# Altium schematic sheet H_BRIGDE.SchDoc
size A4; SheetNumber: 3; SheetTotal: 4
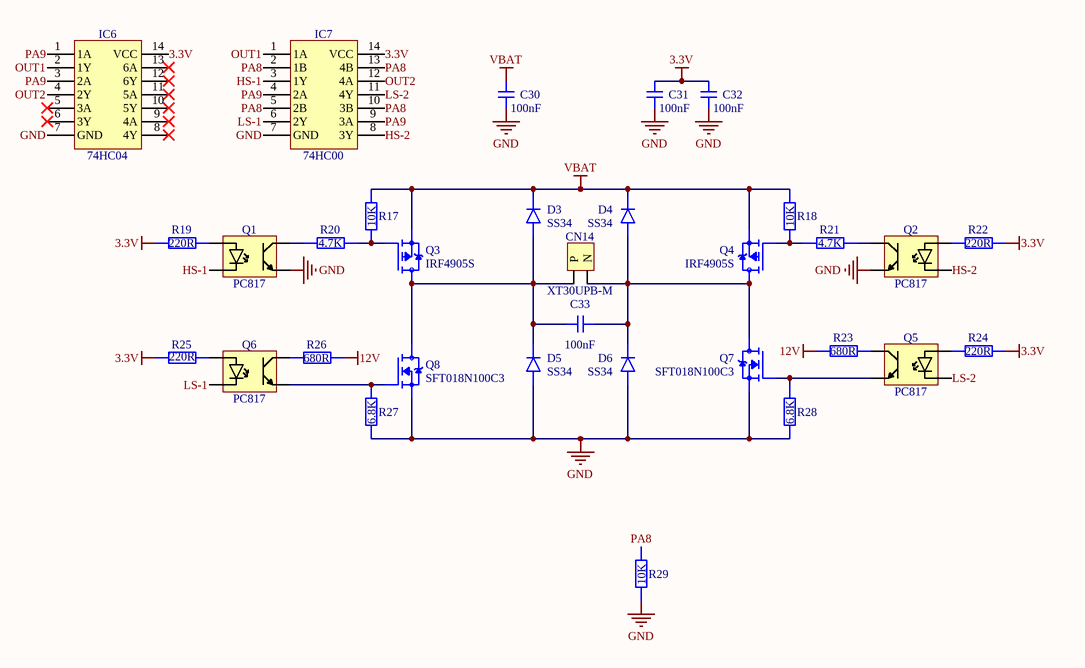
[diagram p0: H_BRIGDE.SchDoc]

## Parts
C30  100nF  [CAP-0603-2]
C31  100nF  [CAP-0603-2]
C32  100nF  [CAP-0603-2]
C33  100nF  [CAP-0603-2]
CN14  XT30UPB-M  [XT30UPB-M]
D3  SS34  [SMA(DO-214AC)]
D4  SS34  [SMA(DO-214AC)]
D5  SS34  [SMA(DO-214AC)]
D6  SS34  [SMA(DO-214AC)]
IC6  74HC04  [SOP-14]
IC7  74HC00  [SOP-14]
Q1  PC817  [SOP-4]
Q2  PC817  [SOP-4]
Q3  IRF4905S  [TO-263]
Q4  IRF4905S  [TO-263]
Q5  PC817  [SOP-4]
Q6  PC817  [SOP-4]
Q7  SFT018N100C3  [TOLL]
Q8  SFT018N100C3  [TOLL]
R17  10K  [RES-0603-1]
R18  10K  [RES-0603-1]
R19  220R  [RES-0603-1]
R20  4.7K  [RES-0603-1]
R21  4.7K  [RES-0603-1]
R22  220R  [RES-0603-1]
R23  680R  [RES-0603-1]
R24  220R  [RES-0603-1]
R25  220R  [RES-0603-1]
R26  680R  [RES-0603-1]
R27  6.8K  [RES-0603-1]
R28  6.8K  [RES-0603-1]
R29  10K  [RES-0603-1]

## Nets
3.3V: C31.1 C32.1 IC6.14(VCC) IC7.14(VCC) R19.2 R22.1 R24.1 R25.2
12V: R23.2 R26.2
GND: C30.2 C31.2 C32.2 D5.1(A) D6.1(A) IC6.7(GND) IC7.7(GND) Q1.3(E) Q2.3(E) Q7.2(S) Q8.2(S) R27.1 R28.1 R29.1
VBAT: C30.1 D3.2(K) D4.2(K) Q3.3(S) Q4.3(S) R17.2 R18.2
HS-1: IC7.3(1Y) Q1.2(K)
HS-2: IC7.8(3Y) Q2.2(K)
LS-1: IC7.6(2Y) Q6.2(K)
LS-2: IC7.11(4Y) Q5.2(K)
OUT1: IC6.2(1Y) IC7.1(1A)
OUT2: IC6.4(2Y) IC7.12(4A)
PA8: IC7.2(1B) IC7.5(2B) IC7.10(3B) IC7.13(4B) R29.2
PA9: IC6.1(1A) IC6.3(2A) IC7.4(2A) IC7.9(3A)
NetC33_1: C33.1 CN14.2(N) D4.1(A) D6.2(K) Q4.2(D) Q7.3(D)
NetC33_2: C33.2 CN14.1(P) D3.1(A) D5.2(K) Q3.2(D) Q8.3(D)
NetQ1_1: Q1.1(A) R19.1
NetQ1_4: Q1.4(C) R20.1
NetQ2_1: Q2.1(A) R22.2
NetQ2_4: Q2.4(C) R21.2
NetQ3_1: Q3.1(G) R17.1 R20.2
NetQ4_1: Q4.1(G) R18.1 R21.1
NetQ5_1: Q5.1(A) R24.2
NetQ5_3: Q5.3(E) Q7.1(G) R28.2
NetQ5_4: Q5.4(C) R23.1
NetQ6_1: Q6.1(A) R25.1
NetQ6_3: Q6.3(E) Q8.1(G) R27.2
NetQ6_4: Q6.4(C) R26.1

Not connected (* = marked no-connect by the designer): IC6 5(3A)* 6(3Y)* 8(4Y)* 9(4A)* 10(5Y)* 11(5A)* 12(6Y)* 13(6A)*

## Notes on the sheet
- Title:
- Size:
- Date:
- Project:
- A4
- Sheet
- of
- File:
- D:\1_ALTIUM

## Library data of the parts
C30-C33 = CL10B104KB8NNNC: 100nF ±10% 50V Ceramic Capacitor X7R 0603; Manufacturer: Samsung Electro-Mechanics; Package: 0603; LCSC Part #: C1591; Mfr.Part #: CL10B104KB8NNNC; DigiKey Part Number: 1276-1000-2-ND; ComponentLink1Description: Link; ComponentLink1URL: https://www.lcsc.com/product-detail/C1591.html?s_z=n_CL10B104KB8NNC; ComponentLink2Description: Link 1; ComponentLink2URL: https://www.digikey.com/en/products/detail/samsung-electro-mechanics/CL10B104KB8NNNC/3886658?s=N4IgTCBcDaIMIBkCMAGAQqgLAaTQDgDki4QBdAXyA
CN14 = XT30UPB-M: Banana and Tip Connector Adapters; Manufacturer: Changzhou Amass Elec; Mfr.Part #: XT30PW-M30.G.Y; LCSC Part #: C428721; Package: Through Hole; DigiKey Part Number: NO; ComponentLink1Description: Link; ComponentLink1URL: https://www.lcsc.com/product-detail/C431092.html?s_z=n_xt30; ComponentLink2Description: Link 1
D3-D6 = SS34: Diode Independent 40V 3A Surface Mount SMA(DO-214AC); Manufacturer: GOODWORK; Mfr.Part #: SS34; Package: SMA(DO-214AC); LCSC Part #: C908680; DigiKey Part Number: NO; ComponentLink1Description: Link; ComponentLink1URL: https://www.lcsc.com/product-detail/C908680.html?s_z=n_C908680
IC6 = SN74HC04DR: 2V~6V 16ns@6V,50pF 2uA 6 1 SOIC-14 Gates and Inverters RoHS; Manufacturer: TI; Mfr.Part #: SN74HC04DR; Package: SOIC-14; LCSC Part #: C6811; DigiKey Part Number: 296-1189-2-ND; ComponentLink1Description: Link; ComponentLink1URL: https://www.lcsc.com/product-detail/C6811.html?s_z=n_74HC04; ComponentLink2Description: Link 1; ComponentLink2URL: https://www.digikey.com/en/products/detail/texas-instruments/SN74HC04DR/276832
IC7 = SN74HC00DR: 2uA 2V~6V 15ns@6V,50pF SOIC-14 Gates and Inverters RoHS; Manufacturer: TI; Mfr.Part #: SN74HC00DR; Package: SOIC-14; LCSC Part #: C10090; DigiKey Part Number: 296-1187-2-ND; ComponentLink1Description: Link; ComponentLink1URL: https://www.lcsc.com/product-detail/C10090.html?s_z=n_74hc00; ComponentLink2Description: Link 1; ComponentLink2URL: https://www.digikey.com/en/products/detail/texas-instruments/SN74HC00DR/276830
Q1 Q2 Q5 Q6 = PC817C-S: Phototransistor Output 5kVrms 1 Channel SOP-4-2.54mm; Manufacturer: UMW; Mfr.Part #: PC817C-S; Package: SOP-4-2.54mm; LCSC Part #: C3008369; DigiKey Part Number: NO; ComponentLink1Description: Link; ComponentLink1URL: https://www.lcsc.com/product-detail/C3008369.html?s_z=n_C3008369; ComponentLink2Description: Link 1
Q3 Q4 = IRF4905STRLPBF: P-Channel 55V 70A 170W Surface Mount D2PAK; Manufacturer: Infineon; Package: D2PAK; Mfr.Part #: IRF4905STRLPBF; LCSC Part #: C2620; DigiKey Part Number: IRF4905STRLPBFTR-ND; ComponentLink1Description: Link; ComponentLink1URL: https://www.lcsc.com/product-detail/C2620.html?s_z=n_IRF4905S; ComponentLink2Description: Link 1; ComponentLink2URL: https://www.digikey.com/en/products/detail/infineon-technologies/IRF4905STRLPBF/1928283?s=N4IgTCBcDaIJICUBiAWAnABgKwGUAqCAMgAoBCSIAugL5A
Q7 Q8 = SFT018N100C3: N-Channel 100V 320A 312W Surface Mount TOLL; Manufacturer: SCILICON; Package: TOLL; Mfr.Part #: SFT018N100C3; LCSC Part #: C42395330; DigiKey Part Number: NO; ComponentLink1Description: Link; ComponentLink1URL: https://www.lcsc.com/product-detail/C42395330.html?s_z=n_c42395330; ComponentLink2Description: Link 1
R17 R18 R29 = RC0603FR-0710KL: 100mW 10kΩ 75V Thick Film Resistor ±100ppm/℃ ±1% 0603 Chip Resistor - Surface Mount RoHS; Manufacturer: YAGEO; Package: 0603; LCSC Part #: C98220; Mfr.Part #: RC0603FR-0710KL; DigiKey Part Number: 311-10.0KHRTR-ND; ComponentLink1Description: Link; ComponentLink1URL: https://www.lcsc.com/product-detail/C98220.html?s_z=n_C98220; ComponentLink2Description: Link 1; ComponentLink2URL: https://www.digikey.com/en/products/detail/yageo/RC0603FR-0710KL/726880?s=N4IgTCBcDaIMwEYEFoEAYB0aDSAJASgCr7IByAIiALoC%2BQA
R19 R22 R24 R25 = 0603WAF2200T5E: 220Ω ±1% 100mW 0603 Thick Film Resistor; Manufacturer: UNI-ROYAL; Mfr.Part #: 0603WAF2200T5E; Package: 0603; LCSC Part #: C22962; DigiKey Part Number: NO; ComponentLink1Description: Link; ComponentLink1URL: https://www.lcsc.com/product-detail/C22962.html?s_z=n_0603waf22; ComponentLink2Description: Link 1
R20 R21 = RC0603FR-074K7L: 100mW 4.7kΩ 75V Thick Film Resistor ±100ppm/℃ ±1% 0603 Chip Resistor - Surface Mount RoHS; Manufacturer: YAGEO; Mfr.Part #: RC0603FR-074K7L; Package: 0603; LCSC Part #: C99782; DigiKey Part Number: 311-4.70KHRTR-ND; ComponentLink1Description: Link; ComponentLink1URL: https://www.lcsc.com/product-detail/C99782.html?s_z=n_4.7K; ComponentLink2Description: Link 1; ComponentLink2URL: https://www.digikey.com/en/products/detail/yageo/RC0603FR-074K7L/727212?s=N4IgTCBcDaIEoGEAMA2JBmAYnAtEg7ACwDS%2BAMiALoC%2BQA
R23 R26 = FRC0603F6800TS: 680Ω ±1% 100mW 0603 Thick Film Resistor; Manufacturer: FOJAN; Mfr.Part #: FRC0603F6800TS; Package: 0603; LCSC Part #: C2907062; DigiKey Part Number: NO; ComponentLink1Description: Link; ComponentLink1URL: https://www.lcsc.com/product-detail/C2907062.html?s_z=n_680r; ComponentLink2Description: Link 1
R27 R28 = 0603WAF6801T5E: 6.8kΩ ±1% 100mW 0603 Thick Film Resistor; Manufacturer: UNI-ROYAL; Mfr.Part #: 0603WAF6801T5E; Package: 0603; LCSC Part #: C23212; DigiKey Part Number: NO; ComponentLink1Description: Link; ComponentLink1URL: https://www.lcsc.com/product-detail/C23212.html?s_z=n_C23212; ComponentLink2Description: Link 1